# EAGLE design PDM_2019_RevB (EAGLE 9.1.3)

## Sheet 1 of 4
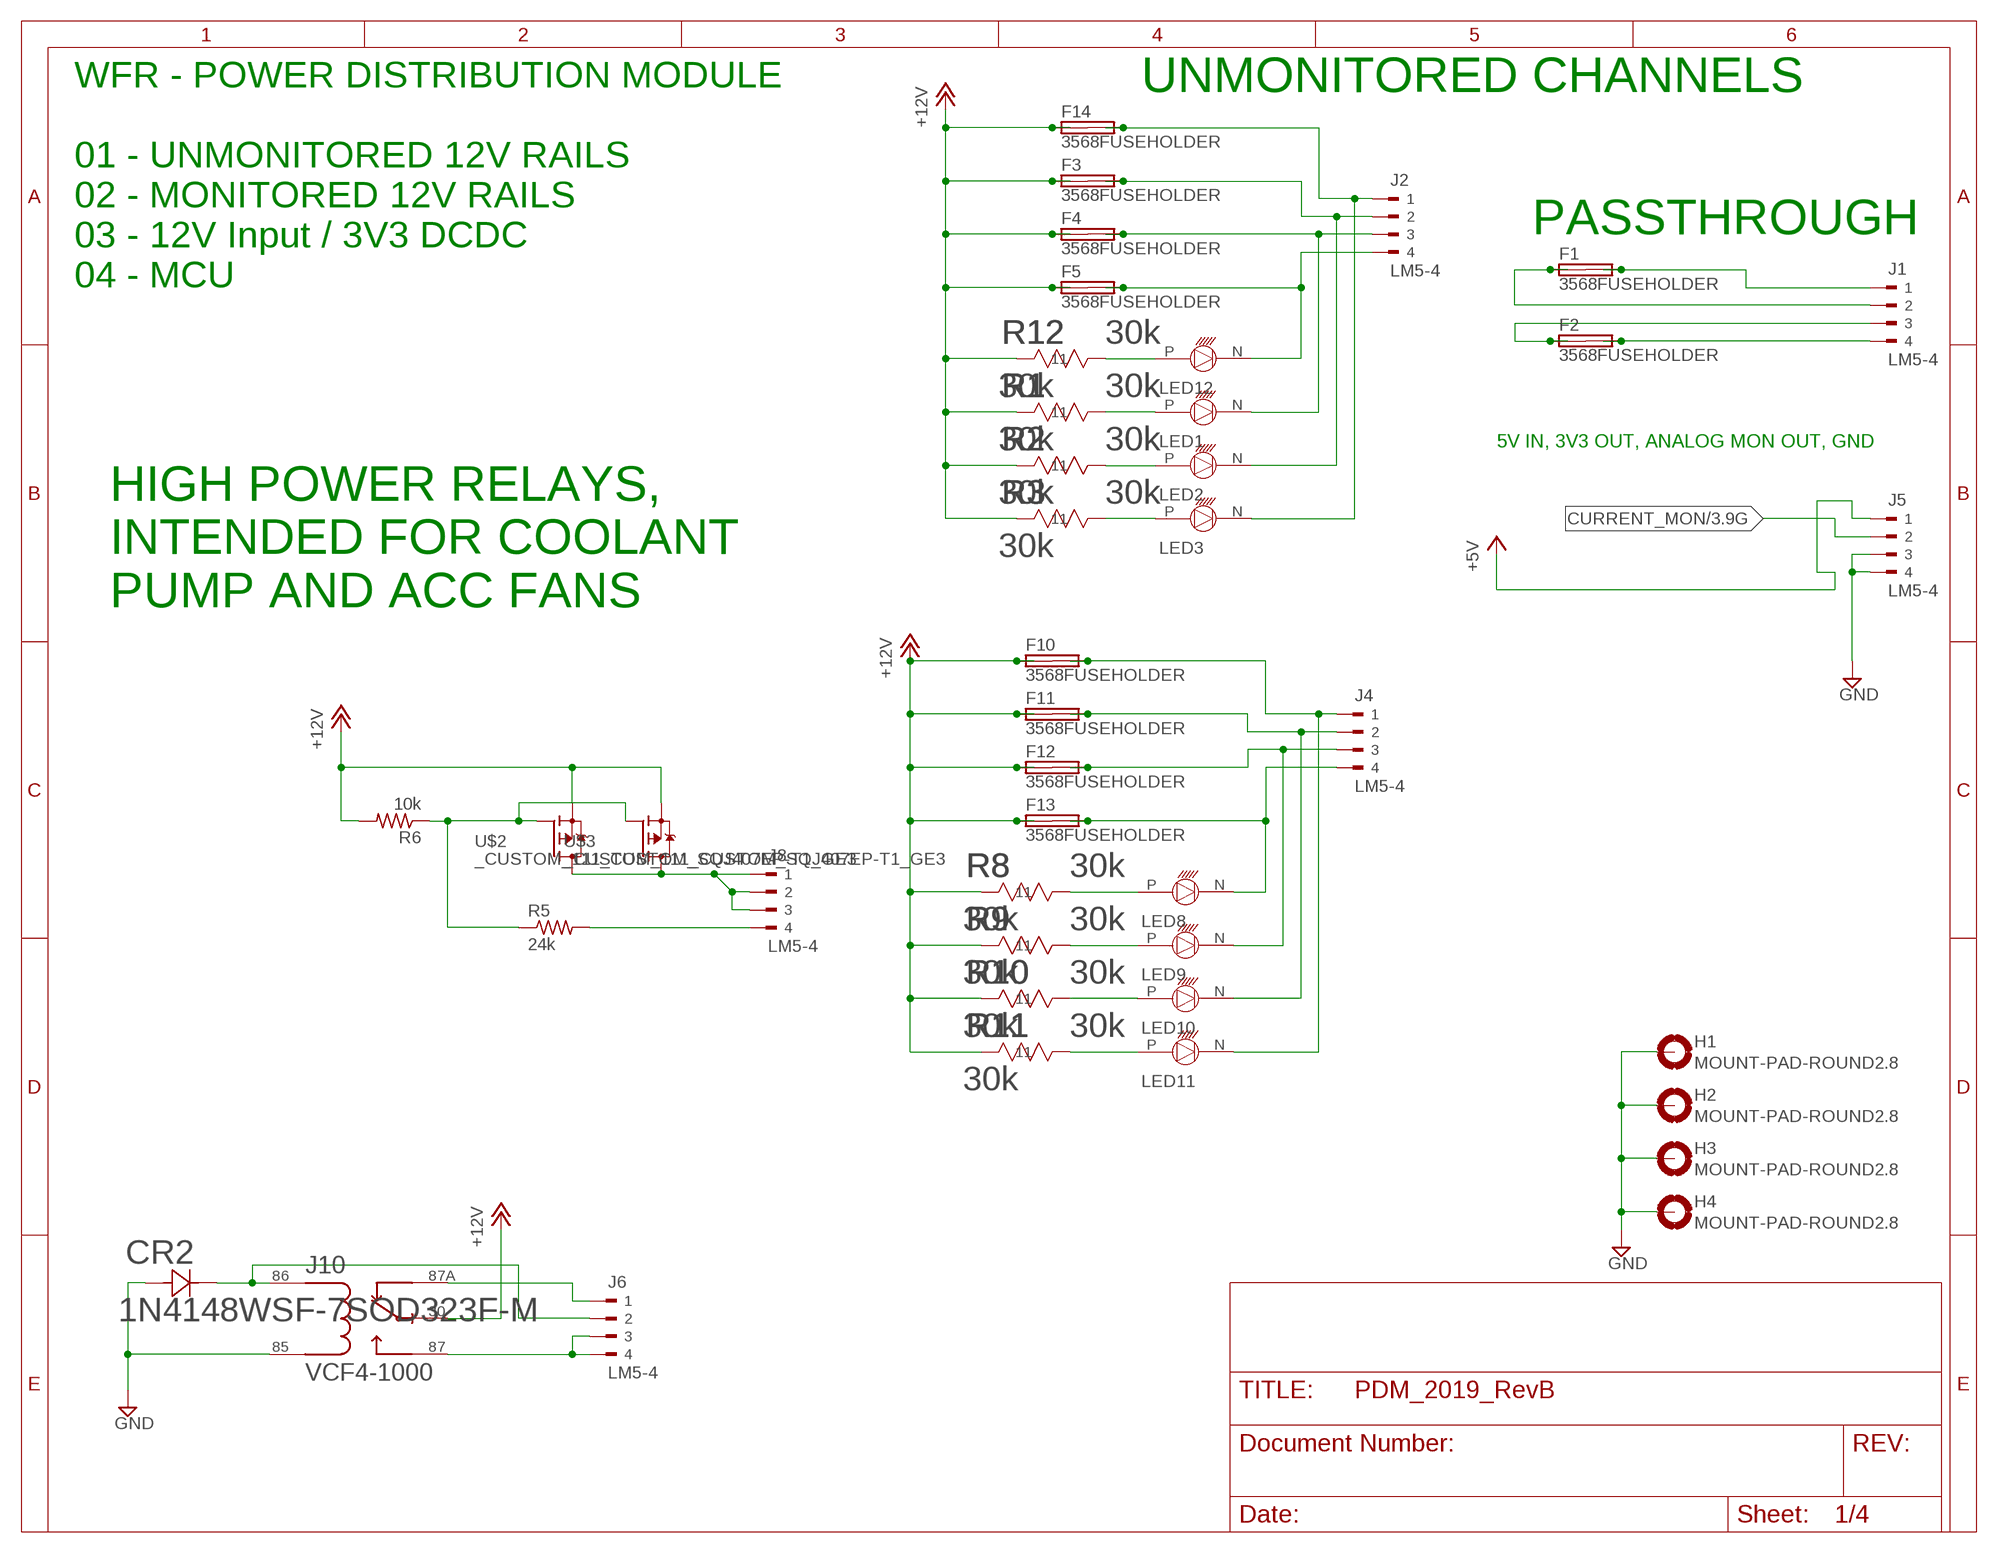
[diagram p0: schematic, sheet 1]

### Parts
CR2  1N4148WSF-7SOD323F-M  [SOD323F-M]
F1  3568FUSEHOLDER  [3568]
F2  3568FUSEHOLDER  [3568]
F3  3568FUSEHOLDER  [3568]
F4  3568FUSEHOLDER  [3568]
F5  3568FUSEHOLDER  [3568]
F10  3568FUSEHOLDER  [3568]
F11  3568FUSEHOLDER  [3568]
F12  3568FUSEHOLDER  [3568]
F13  3568FUSEHOLDER  [3568]
F14  3568FUSEHOLDER  [3568]
H1  MOUNT-PAD-ROUND2.8  [2,8-PAD]
H2  MOUNT-PAD-ROUND2.8  [2,8-PAD]
H3  MOUNT-PAD-ROUND2.8  [2,8-PAD]
H4  MOUNT-PAD-ROUND2.8  [2,8-PAD]
J1  LM5-4  [281-1423]
J2  LM5-4  [281-1423]
J4  LM5-4  [281-1423]
J5  LM5-4  [281-1423]
J6  LM5-4  [281-1423]
J8  LM5-4  [281-1423]
J10  VCF4-1000  [TE_VCF4-1000]
LED1  5MM_LED  [5MM_LED]
LED2  5MM_LED  [5MM_LED]
LED3  5MM_LED  [5MM_LED]
LED8  5MM_LED  [5MM_LED]
LED9  5MM_LED  [5MM_LED]
LED10  5MM_LED  [5MM_LED]
LED11  5MM_LED  [5MM_LED]
LED12  5MM_LED  [5MM_LED]
R1  30k  RMCF0805JT30K0  [STA_RMCF0805]
R2  30k  RMCF0805JT30K0  [STA_RMCF0805]
R3  30k  RMCF0805JT30K0  [STA_RMCF0805]
R5  24k  R-US_M0805  [M0805]
R6  10k  R-US_M0805  [M0805]
R8  30k  RMCF0805JT30K0  [STA_RMCF0805]
R9  30k  RMCF0805JT30K0  [STA_RMCF0805]
R10  30k  RMCF0805JT30K0  [STA_RMCF0805]
R11  30k  RMCF0805JT30K0  [STA_RMCF0805]
R12  30k  RMCF0805JT30K0  [STA_RMCF0805]
U$2  _CUSTOM_111_CUSTOM_SQJ407EP-T1_GE3  [_CUSTOM_111_CUSTOM_TRANS_SIRA90DP-T1-GE3]
U$3  _CUSTOM_111_CUSTOM_SQJ407EP-T1_GE3  [_CUSTOM_111_CUSTOM_TRANS_SIRA90DP-T1-GE3]

### Nets
+5V [SIG]: J5.P$1 ; also sheet 2,3,4
+12V: F3.L1(1A) F3.L2(1B) F4.L1(1A) F4.L2(1B) F5.L1(1A) F5.L2(1B) F10.L1(1A) F10.L2(1B) F11.L1(1A) F11.L2(1B) F12.L1(1A) F12.L2(1B) F13.L1(1A) F13.L2(1B) F14.L1(1A) F14.L2(1B) J10.30 R1.1 R2.1 R3.1 R6.2 R8.1 R9.1 R10.1 R11.1 R12.1 U$2.1(S) U$2.2(S) U$2.3(S) U$3.1(S) U$3.2(S) U$3.3(S) ; also sheet 2,3
CURRENT_MON [SIG]: J5.P$2 ; also sheet 3,4
GND [SIG]: CR2.2 H1.B2,8(MOUNT) H2.B2,8(MOUNT) H3.B2,8(MOUNT) H4.B2,8(MOUNT) J5.P$3 J5.P$4 J10.85 ; also sheet 2,3,4
N$1: F1.R1(2A) F1.R2(2B) J1.P$1
N$2: F1.L1(1A) F1.L2(1B) J1.P$2
N$3: F2.L1(1A) F2.L2(1B) J1.P$3
N$4: LED11.P R11.2
N$5: LED12.P R12.2
N$6: F4.R1(2A) F4.R2(2B) J2.P$3 LED1.N
N$7: F5.R1(2A) F5.R2(2B) J2.P$4 LED12.N
N$9: J8.P$4 R5.2
N$12: J8.P$1 J8.P$2 J8.P$3 U$2.5(D) U$3.5(D)
N$13: F10.R1(2A) F10.R2(2B) J4.P$1 LED11.N
N$14: F13.R1(2A) F13.R2(2B) J4.P$4 LED8.N
N$15: F12.R1(2A) F12.R2(2B) J4.P$3 LED9.N
N$16: F11.R1(2A) F11.R2(2B) J4.P$2 LED10.N
N$18: R5.1 R6.1 U$2.4(G) U$3.4(G)
N$19: LED10.P R10.2
N$21: LED8.P R8.2
N$22: CR2.1 J6.P$2 J10.86
N$24: LED9.P R9.2
N$25: F2.R1(2A) F2.R2(2B) J1.P$4
N$30: LED1.P R1.2
N$31: LED2.P R2.2
N$32: LED3.P R3.2
N$33: F3.R1(2A) F3.R2(2B) J2.P$2 LED2.N
N$34: F14.R1(2A) F14.R2(2B) J2.P$1 LED3.N
N$40: J6.P$3 J6.P$4 J10.87
N$45: J6.P$1 J10.87A

### Notes on the sheet
- UNMONITORED CHANNELS
- PASSTHROUGH
- WFR - POWER DISTRIBUTION MODULE
  
  01 - UNMONITORED 12V RAILS
  02 - MONITORED 12V RAILS
  03 - 12V Input / 3V3 DCDC
  04 - MCU
- 5V IN, 3V3 OUT, ANALOG MON OUT, GND
- HIGH POWER RELAYS,
  INTENDED FOR COOLANT 
  PUMP AND ACC FANS

## Sheet 2 of 4
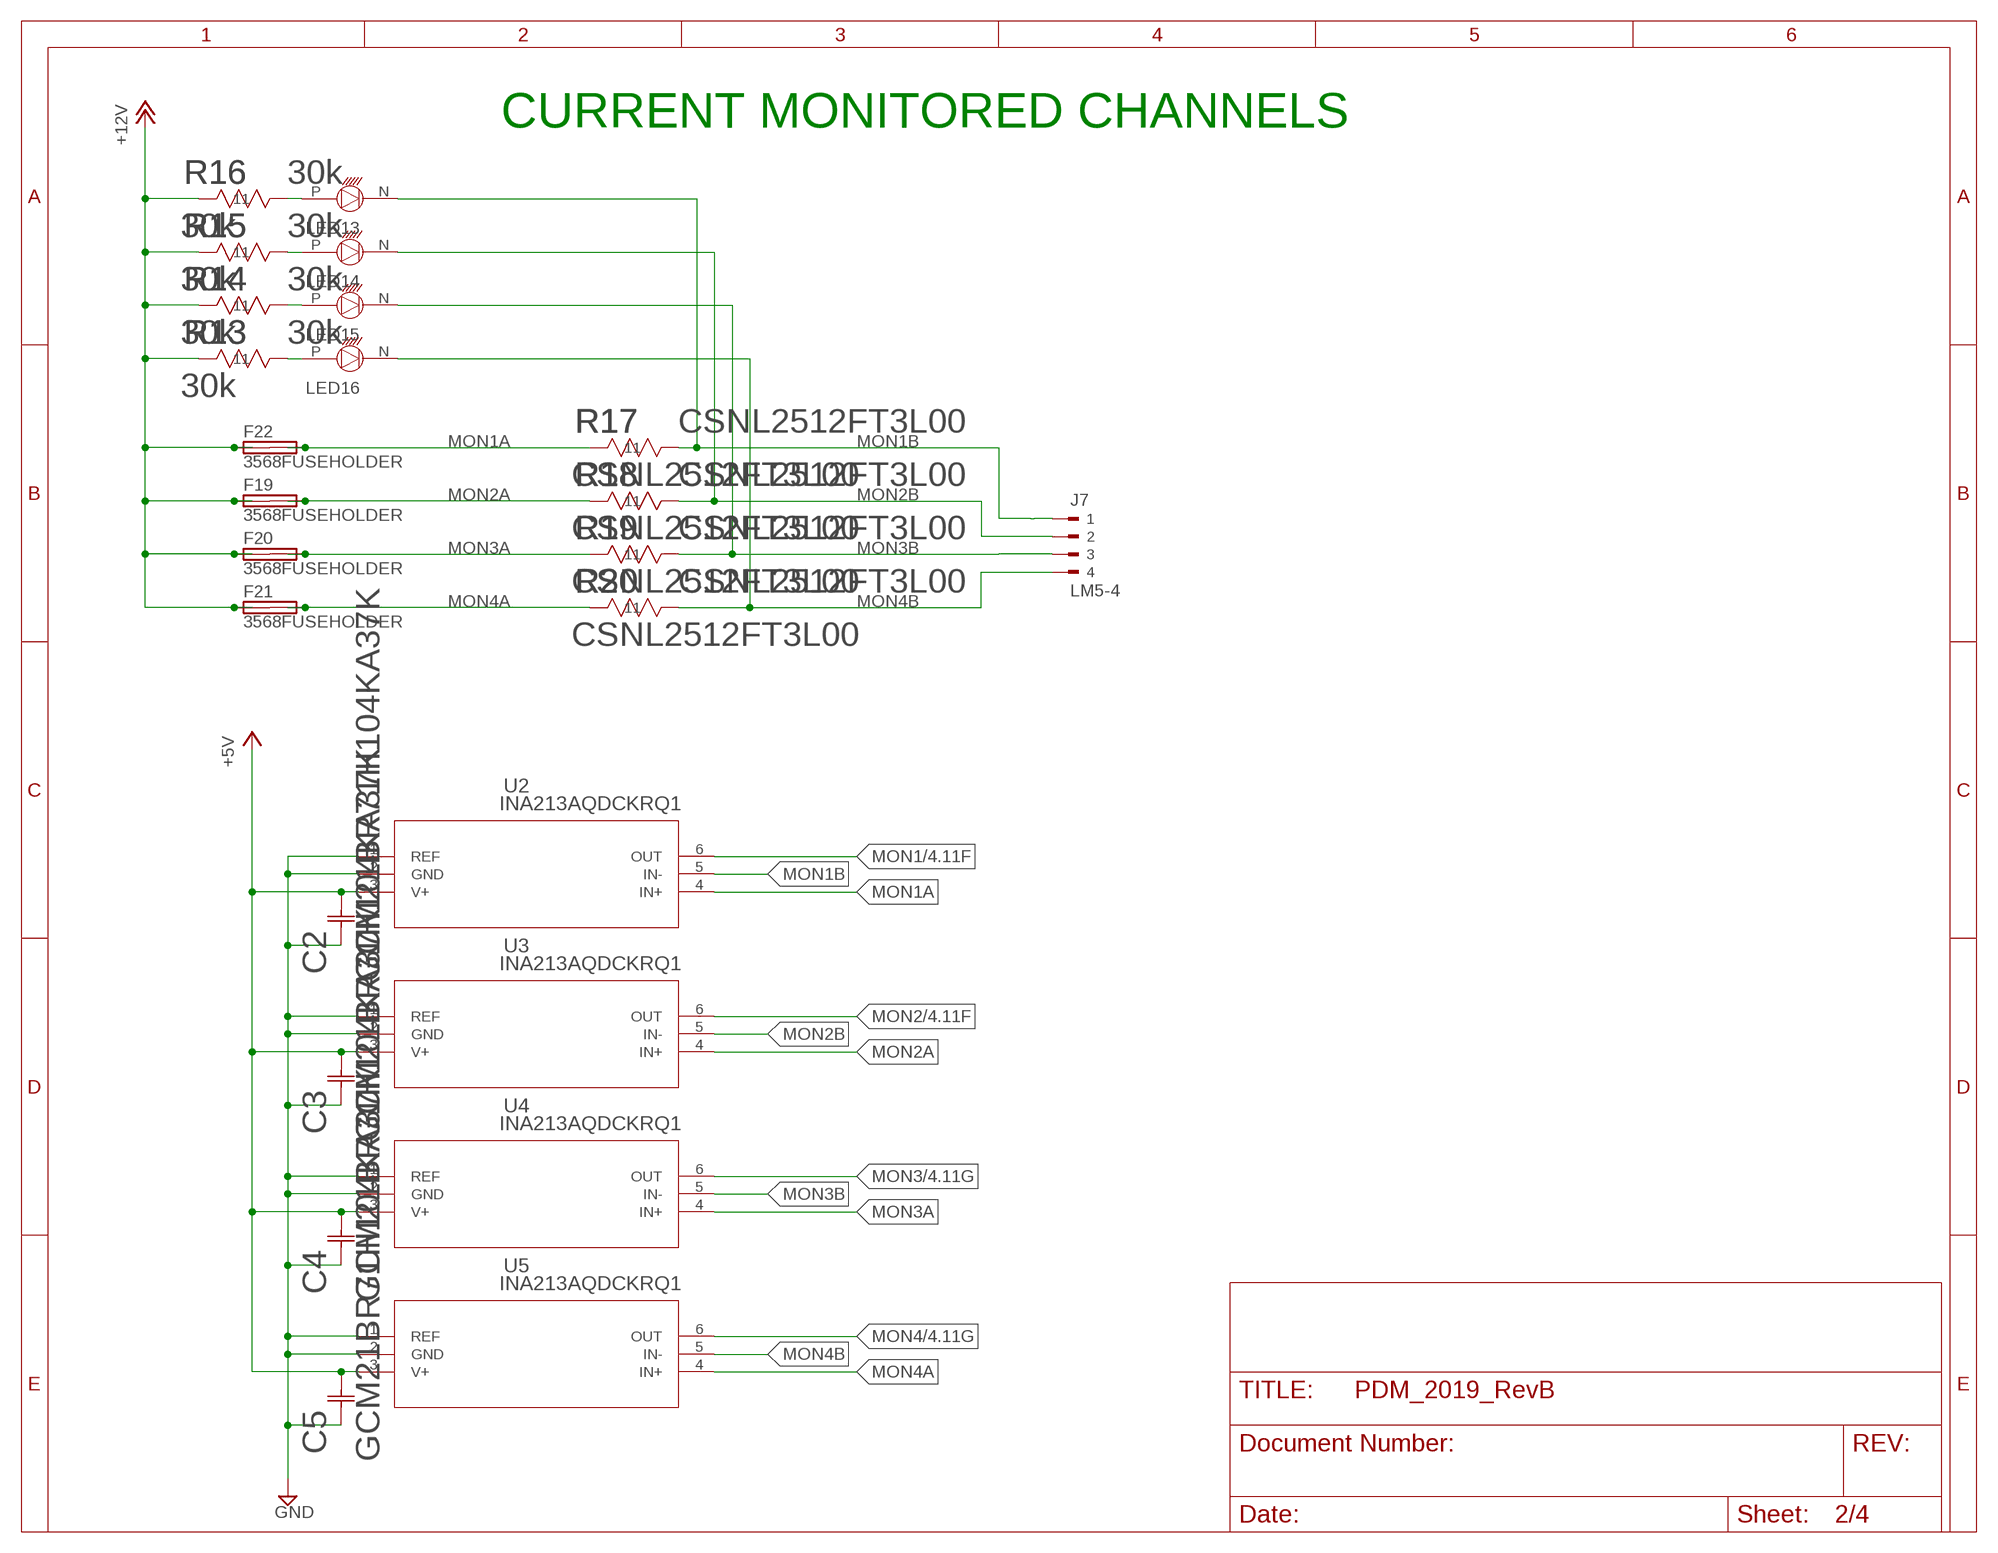
[diagram p1: schematic, sheet 2]

### Parts
C2  GCM21BR71H104KA37K  [G-21]
C3  GCM21BR71H104KA37K  [G-21]
C4  GCM21BR71H104KA37K  [G-21]
C5  GCM21BR71H104KA37K  [G-21]
F19  3568FUSEHOLDER  [3568]
F20  3568FUSEHOLDER  [3568]
F21  3568FUSEHOLDER  [3568]
F22  3568FUSEHOLDER  [3568]
J7  LM5-4  [281-1423]
LED13  5MM_LED  [5MM_LED]
LED14  5MM_LED  [5MM_LED]
LED15  5MM_LED  [5MM_LED]
LED16  5MM_LED  [5MM_LED]
R13  30k  RMCF0805JT30K0  [STA_RMCF0805]
R14  30k  RMCF0805JT30K0  [STA_RMCF0805]
R15  30k  RMCF0805JT30K0  [STA_RMCF0805]
R16  30k  RMCF0805JT30K0  [STA_RMCF0805]
R17  CSNL2512FT3L00  [STA_CSNL2512(3)]
R18  CSNL2512FT3L00  [STA_CSNL2512(3)]
R19  CSNL2512FT3L00  [STA_CSNL2512(3)]
R20  CSNL2512FT3L00  [STA_CSNL2512(3)]
U2  INA213AQDCKRQ1  [DCK6]
U3  INA213AQDCKRQ1  [DCK6]
U4  INA213AQDCKRQ1  [DCK6]
U5  INA213AQDCKRQ1  [DCK6]

### Nets
+5V [SIG]: C2.2 C3.2 C4.2 C5.2 U2.3(V+) U3.3(V+) U4.3(V+) U5.3(V+) ; also sheet 1,3,4
+12V: F19.L1(1A) F19.L2(1B) F20.L1(1A) F20.L2(1B) F21.L1(1A) F21.L2(1B) F22.L1(1A) F22.L2(1B) R13.1 R14.1 R15.1 R16.1 ; also sheet 1,3
GND [SIG]: C2.1 C3.1 C4.1 C5.1 U2.1(REF) U2.2(GND) U3.1(REF) U3.2(GND) U4.1(REF) U4.2(GND) U5.1(REF) U5.2(GND) ; also sheet 1,3,4
MON1 [SIG]: U2.6(OUT) ; also sheet 4
MON1A [SIG]: F22.R1(2A) F22.R2(2B) R17.1 U2.4(IN+)
MON1B [SIG]: J7.P$1 LED13.N R17.2 U2.5(IN-)
MON2 [SIG]: U3.6(OUT) ; also sheet 4
MON2A [SIG]: F19.R1(2A) F19.R2(2B) R18.1 U3.4(IN+)
MON2B [SIG]: J7.P$2 LED14.N R18.2 U3.5(IN-)
MON3 [SIG]: U4.6(OUT) ; also sheet 4
MON3A [SIG]: F20.R1(2A) F20.R2(2B) R19.1 U4.4(IN+)
MON3B [SIG]: J7.P$3 LED15.N R19.2 U4.5(IN-)
MON4 [SIG]: U5.6(OUT) ; also sheet 4
MON4A [SIG]: F21.R1(2A) F21.R2(2B) R20.1 U5.4(IN+)
MON4B [SIG]: J7.P$4 LED16.N R20.2 U5.5(IN-)
N$36: LED16.P R13.2
N$37: LED15.P R14.2
N$38: LED14.P R15.2
N$39: LED13.P R16.2

### Notes on the sheet
- CURRENT MONITORED CHANNELS

## Sheet 3 of 4
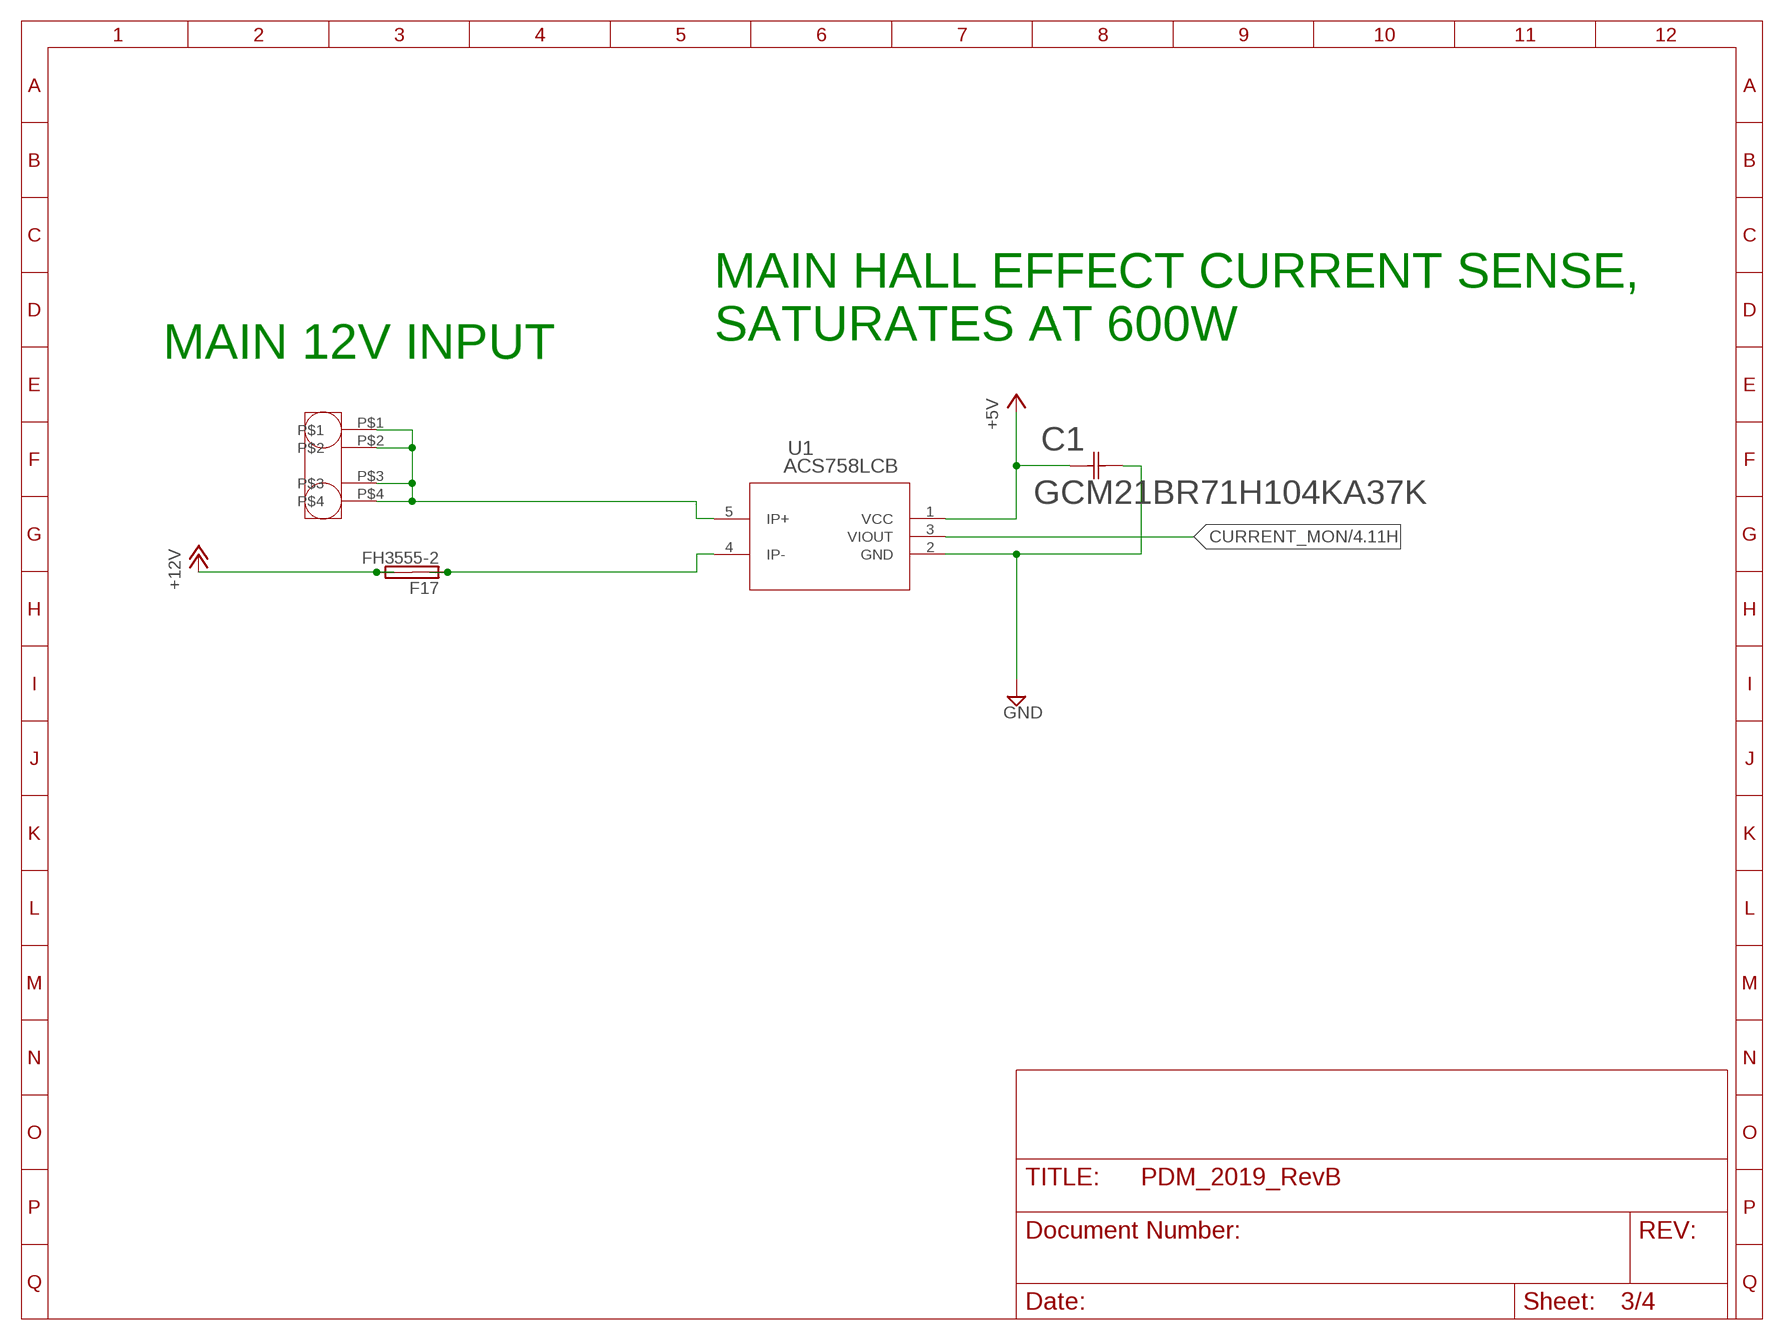
[diagram p2: schematic, sheet 3]

### Parts
C1  GCM21BR71H104KA37K  [G-21]
F17  FH3555-2  [3555-2]
U1  ACS758LCB  [PFF-5]
U$1  1773976  [1773976]

### Nets
+5V [SIG]: C1.1 U1.1(VCC) ; also sheet 1,2,4
+12V: F17.R1(2A) F17.R2(2B) ; also sheet 1,2
CURRENT_MON [SIG]: U1.3(VIOUT) ; also sheet 1,4
GND [SIG]: C1.2 U1.2(GND) ; also sheet 1,2,4
N$8 [RAIL2]: U1.5(IP+) U$1.P$1 U$1.P$2 U$1.P$3 U$1.P$4
N$20 [RAIL2]: F17.L1(1A) F17.L2(1B) U1.4(IP-)

### Notes on the sheet
- MAIN HALL EFFECT CURRENT SENSE,
  SATURATES AT 600W
- MAIN 12V INPUT

## Sheet 4 of 4
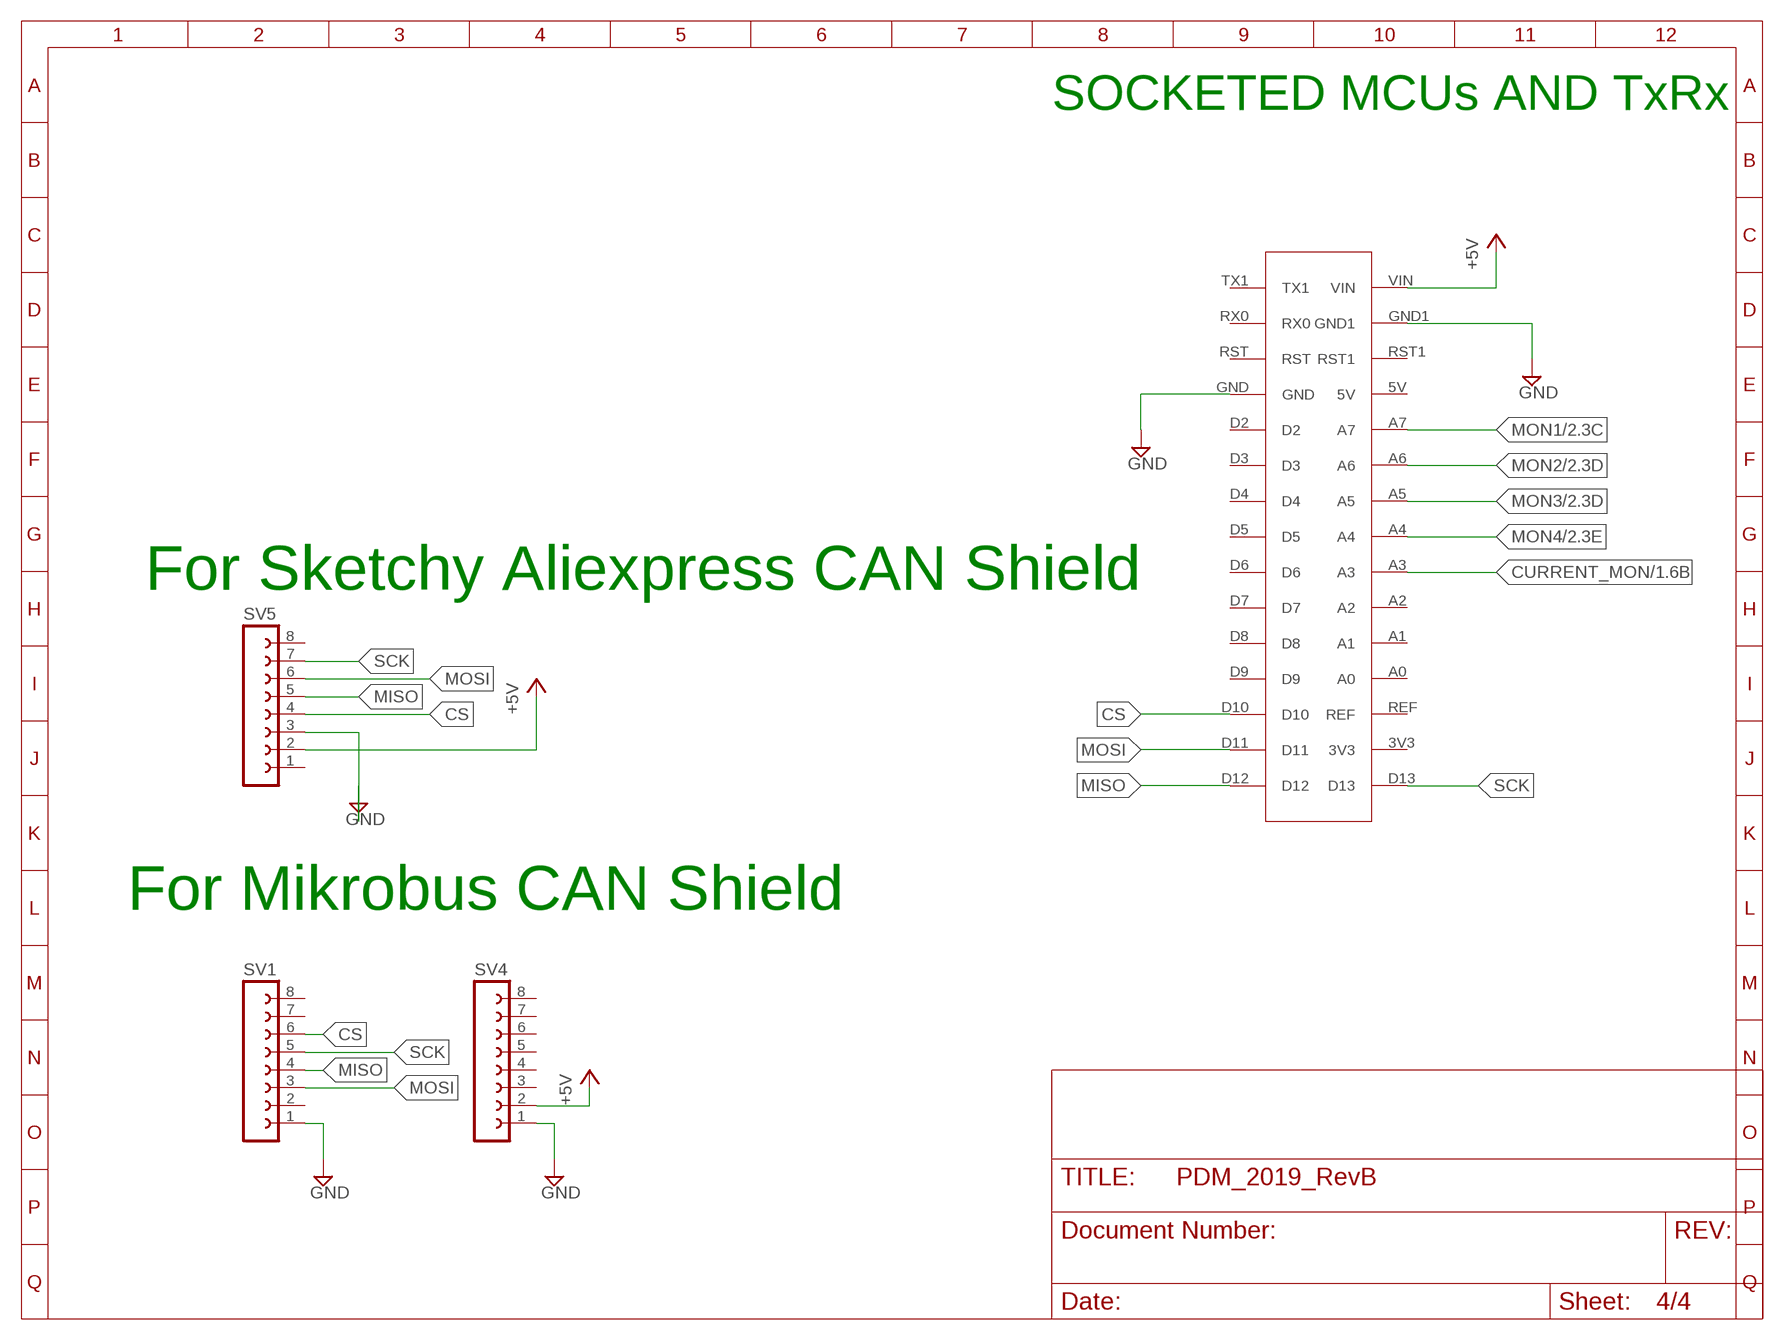
[diagram p3: schematic, sheet 4]

### Parts
SV1  FE08-1  [FE08]
SV4  FE08-1  [FE08]
SV5  FE08-1  [FE08]
U$4  NANO  [NANO]

### Nets
+5V [SIG]: SV4.2 ; also sheet 1,2,3
CS [SIG]: SV1.6 SV5.4 U$4.D10
CURRENT_MON [SIG]: U$4.A3 ; also sheet 1,3
GND [SIG]: SV1.1 SV4.1 U$4.GND U$4.GND1 ; also sheet 1,2,3
MISO [SIG]: SV1.4 SV5.5 U$4.D12
MON1 [SIG]: U$4.A7 ; also sheet 2
MON2 [SIG]: U$4.A6 ; also sheet 2
MON3 [SIG]: U$4.A5 ; also sheet 2
MON4 [SIG]: U$4.A4 ; also sheet 2
MOSI [SIG]: SV1.3 SV5.6 U$4.D11
N$23: U$4.VIN
N$49: SV5.3
N$50 [SIG]: SV5.2 ; supply symbol labelled +5V
SCK [SIG]: SV1.5 SV5.7 U$4.D13
Unconnected: SV1.2 SV1.7 SV1.8 SV4.3 SV4.4 SV4.5 SV4.6 SV4.7 SV4.8 SV5.1 SV5.8 U$4.3V3 U$4.5V U$4.A0 U$4.A1 U$4.A2 U$4.D2 U$4.D3 U$4.D4 U$4.D5 U$4.D6 U$4.D7 U$4.D8 U$4.D9 U$4.REF U$4.RST U$4.RST1 U$4.RX0 U$4.TX1

### Notes on the sheet
- SOCKETED MCUs AND TxRx
- For Sketchy Aliexpress CAN Shield
- For Mikrobus CAN Shield

## Library data of the parts
C1-C5 = PDM_2019_RevB:GCM21BR71H104KA37K; MANUFACTURER_PART_NUMBER: GCM21BR71H104KA37K; VENDOR: Murata
CR2 = PDM_2019_RevB:1N4148WSF-7; MANUFACTURER_PART_NUMBER: 1N4148WSF7; VENDOR: Diodes Inc
F1-F5 F10-F14 F19-F22 = fuse:3568FUSEHOLDER: 3568 20AMP 500VAC
F17 = fuse:FH3555-2
H1-H4 = holes:MOUNT-PAD-ROUND: MOUNTING PAD, round
J1 J2 J4-J8 = con-weidmueller-sl35:LM5-4
J10 = PDM_2019_RevB:VCF4-1000: Socket, Relay; PCB, VTF Series, 1 Pole, Quick-Connect, w/o Grounding Provision; COMMENT: 1393310-3; DESCRIPTION: VCF4-1000=FROM SEC; DIGI-KEY_PART_NUMBER: PB232-ND; DIGI-KEY_PURCHASE_URL: https://www.digikey.ca/product-detail/en/te-connectivity-potter-brumfield-relays/VCF4-1000/PB232-ND/207273?utm_source=snapeda&utm_medium=aggregator&utm_campaign=symbol; MF: TE Connectivity; MP: VCF4-1000; PACKAGE: None; PRODUCT_TYPE: Socket; TE_PURCHASE_URL: https://www.te.com/usa-en/product-1393310-3.html?te_bu=Cor&te_type=disp&te_campaign=seda_glo_cor-seda-global-disp-prtnr-fy19-seda-model-bom-cta_sma-317_1&elqCampaignId=32493
LED1-LED3 LED8-LED16 = PDM_2019_RevB:5MM_LED
R1-R3 R8-R16 = PDM_2019_RevB:RMCF0805JT30K0; MANUFACTURER_PART_NUMBER: RMCF0805JT30K0; VENDOR: Stackpole International
R5 R6 = adafruit:R-US_: RESISTOR, American symbol
R17-R20 = PDM_2019_RevB:CSNL2512FT3L00; MANUFACTURER_PART_NUMBER: CSNL2512FT3L00; VENDOR: Stackpole International
SV1 SV4 SV5 = con-lsta:FE08-1: FEMALE HEADER; OC_FARNELL: unknown; OC_NEWARK: unknown
U1 = PDM_2019_RevB:ACS758LCB; MANUFACTURER_PART_NUMBER: LLC; VENDOR: Allegro Microsystems Inc.
U2-U5 = PDM_2019_RevB:INA213AQDCKRQ1; MANUFACTURER_PART_NUMBER: INA213AQDCKRQ1; VENDOR: Texas Instruments
U$1 = PDM_2019_RevB:1773976
U$2 U$3 = PDM_2019_RevB:_CUSTOM_111_CUSTOM_SQJ407EP-T1_GE3
U$4 = DASHBOARD:NANO

## Net classes
0 RAIL1: width 0.4 mm, drill 0.5 mm, clearance 0.2 mm
1 GND: width 0.4 mm, drill 0.5 mm, clearance 0.2 mm
2 RAIL2: width 0.4 mm, drill 0.5 mm, clearance 0.2 mm
3 SIG: width 0.3 mm, drill 0.5 mm, clearance 0.2 mm

## Board
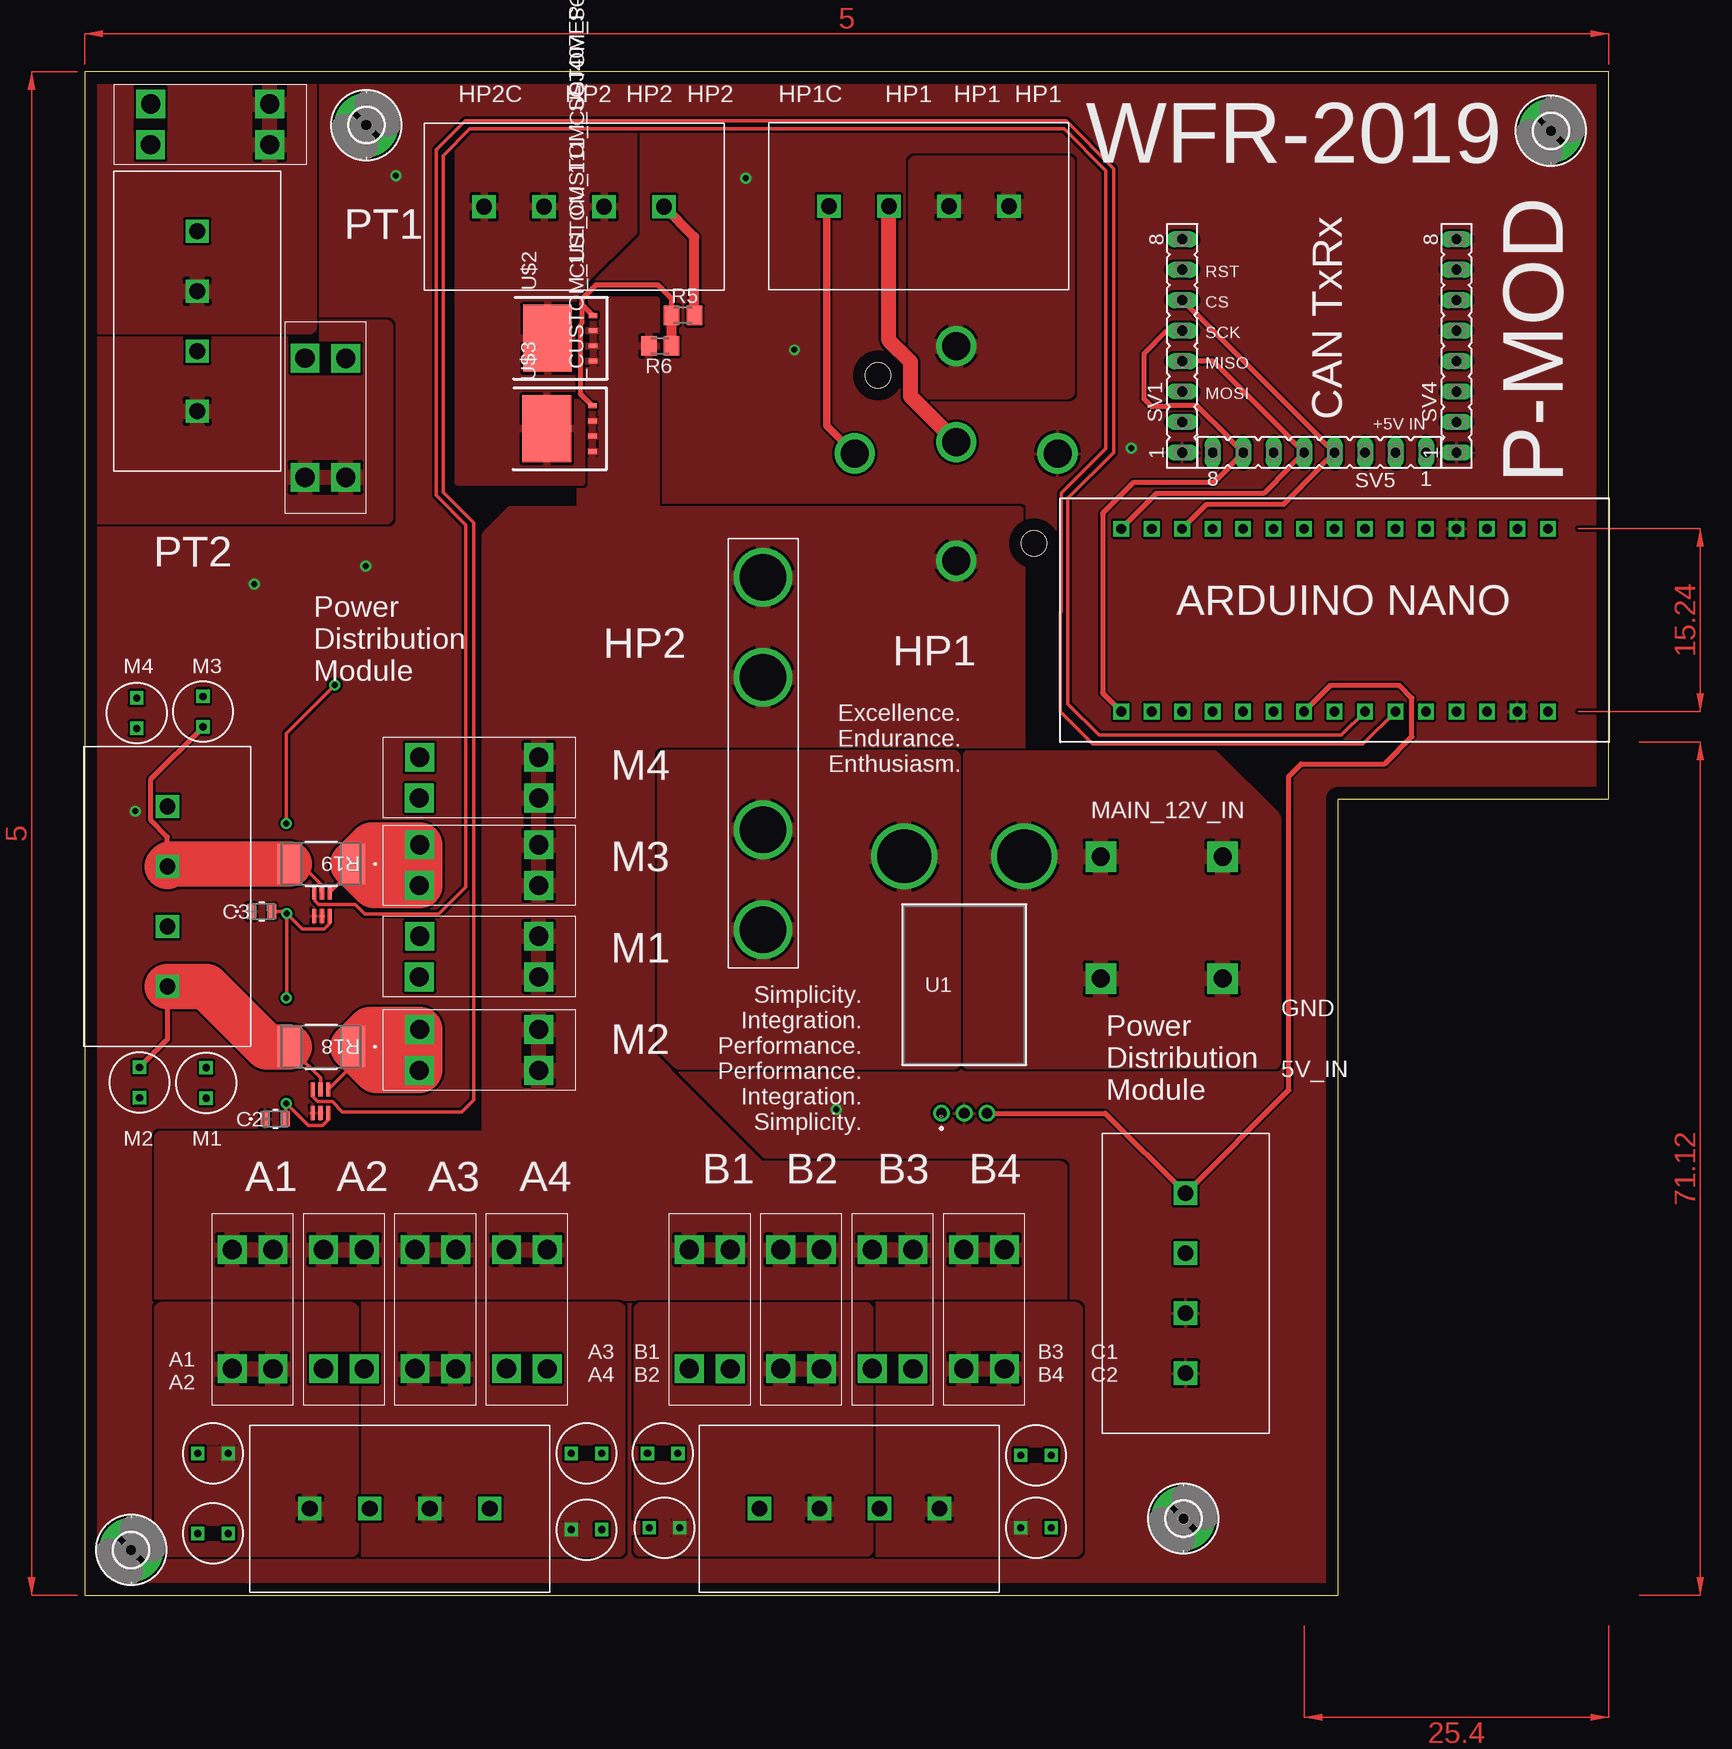
[diagram p4: board, top side]
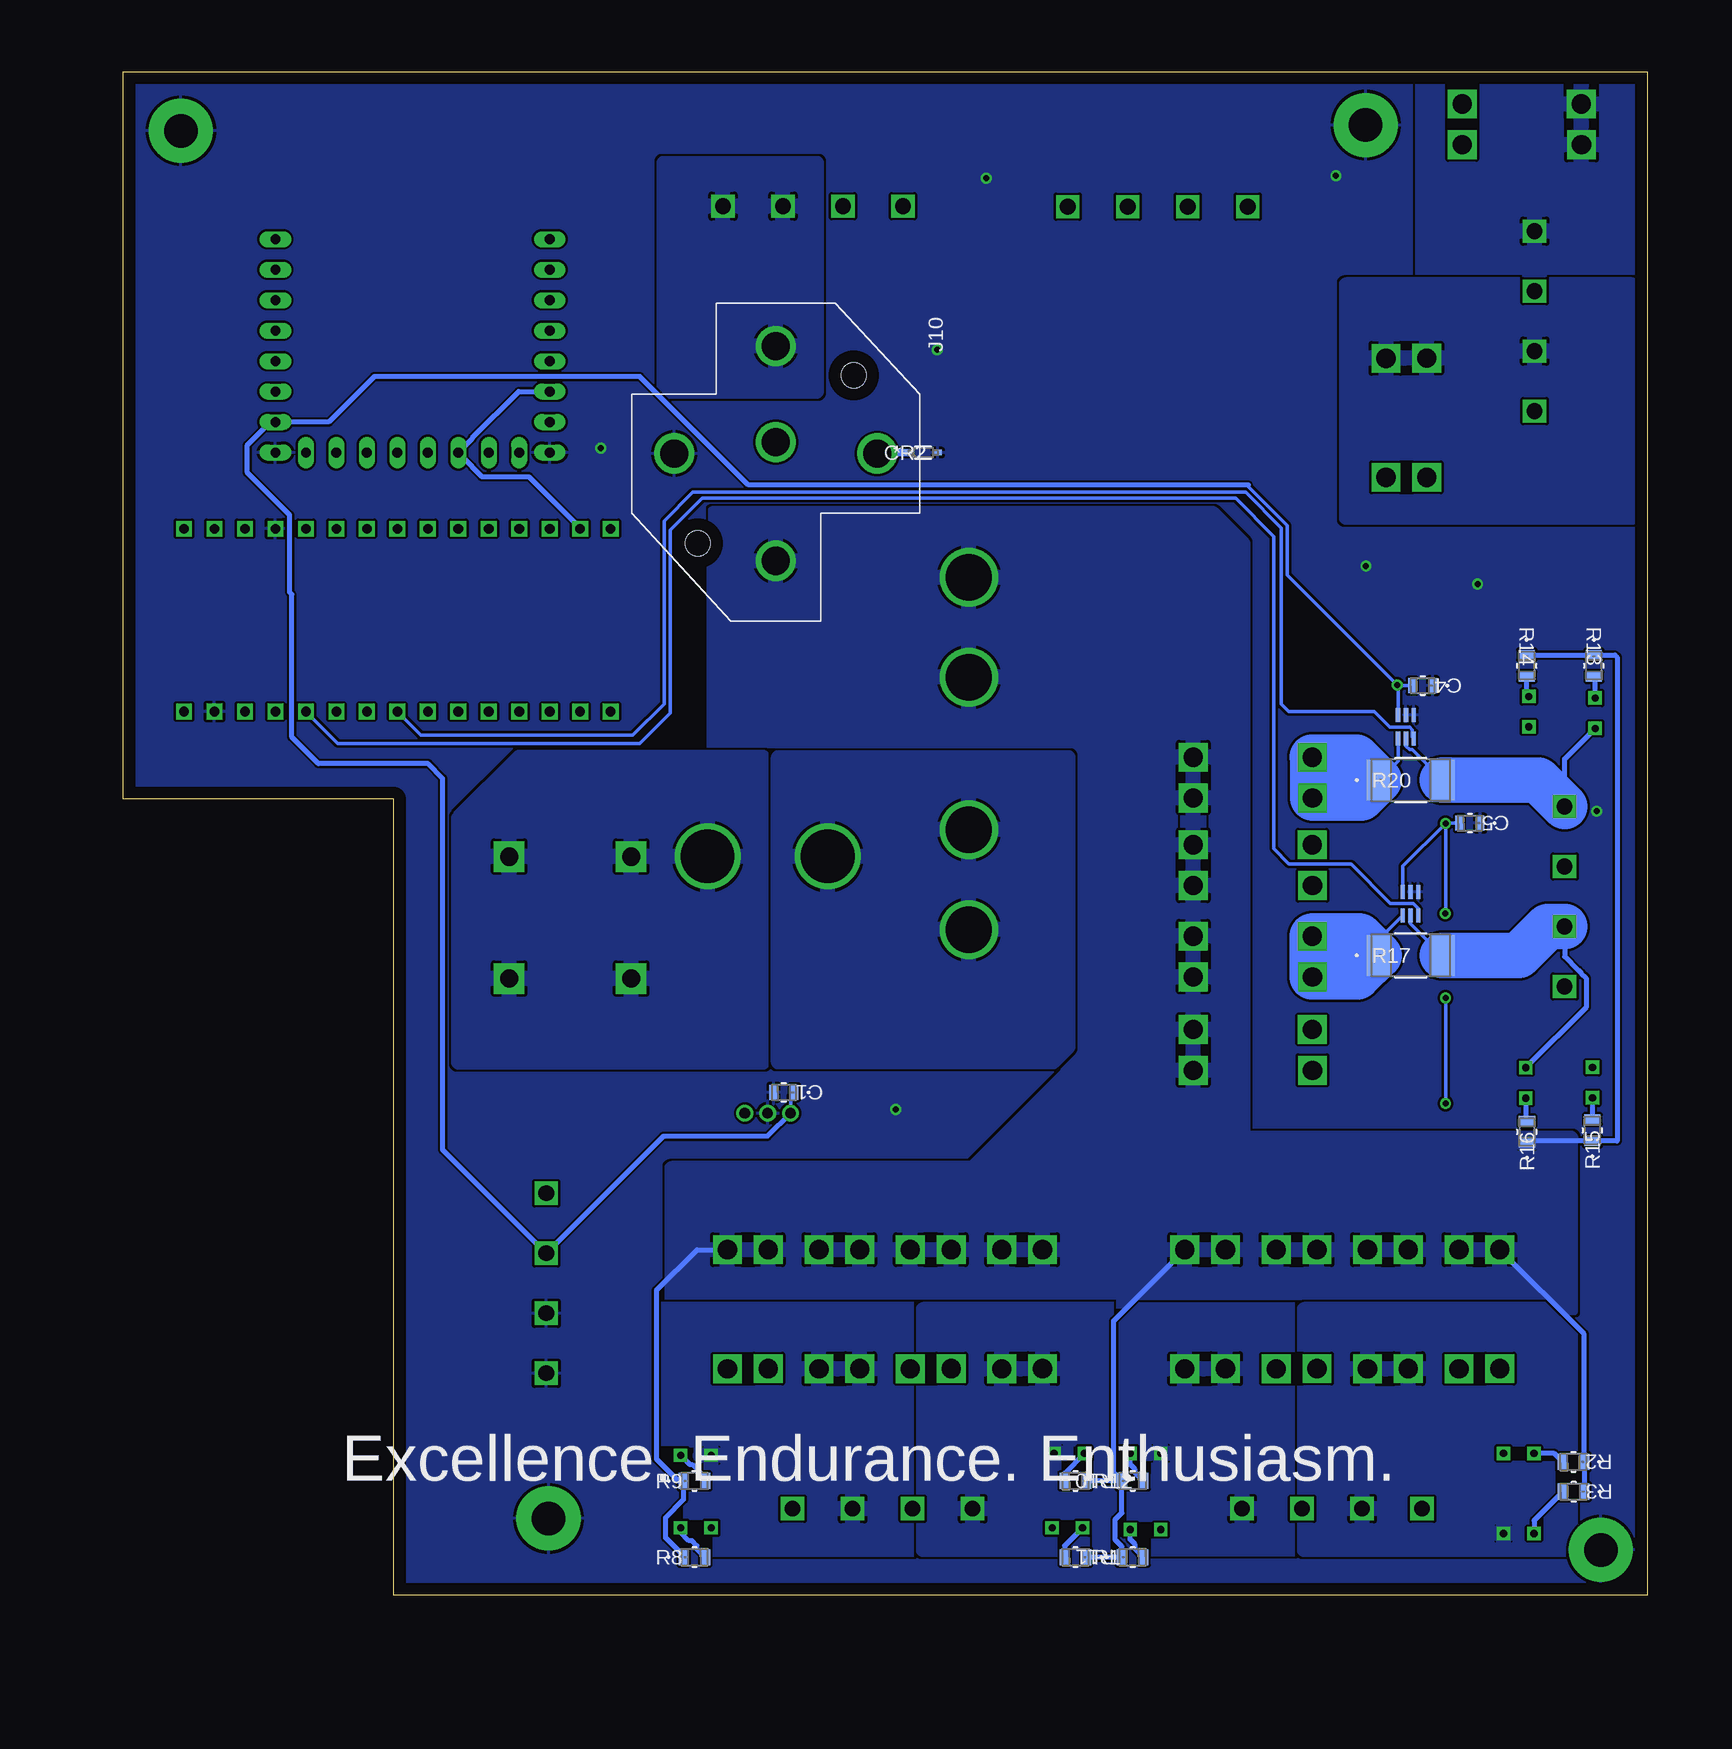
[diagram p5: board, bottom side, seen from below]

Size 127 x 127 mm. Coordinates in mm from the lower left corner, seen from the top.
Outline: 0,0 104.46,0 104.46,66.36 127,66.36 127,127 0,127 0,0
Copper layers (1*16): Top 0.035mm / dielectric 1.5mm / Bottom 0.035mm
Design rules "default": minimum track width 6mil, minimum drill 0.35mm, track to track 6mil, track to pad 6mil, pad to pad 6mil, via to via 6mil, smd to smd 6mil, copper to edge 40mil, drill to drill 6mil, minimum pad ring 10mil, minimum via ring 8mil, stop-mask expansion 4mil, vias tented up to drill 0mil, thermal gap 10mil

### Footprints (pad centres in the part's own frame; a part is rotated, then mirrored left to right if it is on the bottom)
G-21 = smd 0.711 x 1.245: 1 -0.851,0; 2 0.851,0
SOD323F-M = smd 0.705 x 0.452: 1 -1.202,0; 2 1.202,0
3568 = drill 1.6 square: L1 0,3.4; L2 0,0; R1 9.94,3.4; R2 9.92,0
3555-2 = drill 3.86: L1 -14.68,0; L2 -6.35,0; R1 6.35,0; R2 14.68,0
2,8-PAD = drill 2.8 pad 5.334: B2,8 0,0
281-1423 = drill 1.3 square: P$1 -2.5,0; P$2 -7.5,0; P$3 2.5,0; P$4 7.5,0
TE_VCF4-1000 = drill 2.337: 30 8.95,0; 85 0,-8.45; 86 0,8.45; 87 -8.95,0; 87A -0.95,0 | hole 2.1: 7.5,-6.5; -6.5,6.5
5MM_LED = drill 0.6 square: N 0,-1.27; P 0,1.27
STA_RMCF0805 = smd 0.813 x 1.346: 1 -0.902,0; 2 0.902,0
M0805 = smd 1.3 x 1.6: 1 -0.95,0; 2 0.95,0
STA_CSNL2512(3) = smd 2.032 x 3.429: 1 -2.642,0; 2 2.642,0
FE08 = drill 0.813 long: 1 -8.89,0; 2 -6.35,0; 3 -3.81,0; 4 -1.27,0; 5 1.27,0; 6 3.81,0; 7 6.35,0; 8 8.89,0
PFF-5 = drill 0.889 pad 1.397: 1 -3.81,-21.412; 2 -1.905,-21.412; 3 0,-21.412 | drill 4.47 pad 4.978: 4 -6.909,0; 5 3.099,0
DCK6 = smd 1.168 x 0.356: 1 -0.978,0.65; 2 -0.978,0; 3 -0.978,-0.65; 4 0.978,-0.65; 5 0.978,0; 6 0.978,0.65
1773976 = drill 1.51 pad 2.54 square: P$1 0,0; P$2 0,10.16; P$3 10.16,10.16; P$4 10.16,0
_CUSTOM_111_CUSTOM_TRANS_SIRA90DP-T1-GE3 = smd 0.41 x 0.72: 1 -1.905,-2.715; 2 -0.635,-2.715; 3 0.635,-2.715; 4 1.905,-2.715 | smd 5.588 x 4.064: 5 0,1.08
NANO = drill 0.8 square: 3V3 2.54,0; 5V 27.94,0; A0 7.62,0; A1 10.16,0; A2 12.7,0; A3 15.24,0; A4 17.78,0; A5 20.32,0; A6 22.86,0; A7 25.4,0; D2 25.4,15.24; D3 22.86,15.24; D4 20.32,15.24; D5 17.78,15.24; D6 15.24,15.24; D7 12.7,15.24; D8 10.16,15.24; D9 7.62,15.24; D10 5.08,15.24; D11 2.54,15.24; D12 0,15.24; D13 0,0; GND 27.94,15.24; GND1 33.02,0; REF 5.08,0; RST 30.48,15.24; RST1 30.48,0; RX0 33.02,15.24; TX1 35.56,15.24; VIN 35.56,0

### Placement (x,y rotation side)
C1  71.93,41.92 180 bottom
C2  15.88,39.7 0 top
C3  14.73,57 0 top
C4  18.69,75.82 180 bottom
C5  14.76,64.36 180 bottom
CR2  60.33,95.25 0 bottom
F1  21.75,93.19 90 top
F2  15.4,124.3 180 top
F3  12.27,28.8 270 top
F4  27.51,28.8 270 top
F5  35.13,28.8 270 top
F10  57.99,28.8 270 top
F11  50.37,28.8 270 top
F12  65.61,28.8 270 top
F13  73.23,28.8 270 top
F14  19.89,28.8 270 top
F17  56.52,70.17 90 top
F19  37.81,47.16 180 top
F20  37.81,62.55 180 top
F21  37.81,69.86 180 top
F22  37.81,54.93 180 top
H1  91.54,6.39 0 top
H2  23.45,122.56 0 top
H3  3.85,3.77 0 top
H4  122.17,122.07 0 top
J1  9.37,106.2 90 top
J2  26.24,7.21 0 top
J4  63.7,7.21 0 top
J5  91.73,26 270 top
J6  69.5,115.79 0 top
J7  6.87,58.24 90 top
J8  40.77,115.75 0 top
J10  72.61,95.17 270 bottom
LED1  41.8,5.47 270 top
LED2  10.68,11.82 90 top
LED3  10.68,5.15 90 top
LED8  79.26,5.63 270 top
LED9  79.26,11.66 270 top
LED10  48.15,11.82 90 top
LED11  48.3,5.63 90 top
LED12  41.8,11.82 270 top
LED13  10.1,42.71 180 top
LED14  4.55,42.74 180 top
LED15  9.84,73.65 0 top
LED16  4.32,73.53 0 top
R1  42.86,3.17 0 bottom
R2  6.13,11.12 180 bottom
R3  6.11,8.64 180 bottom
R5  49.85,106.68 0 top
R6  47.94,104.14 180 top
R8  79.38,3.17 0 bottom
R9  79.38,9.53 0 bottom
R10  47.62,9.53 180 bottom
R11  47.62,3.17 180 bottom
R12  42.86,9.53 0 bottom
R13  4.43,77.48 270 bottom
R14  10.03,77.48 270 bottom
R15  4.55,38.75 90 bottom
R16  10,38.63 90 bottom
R17  19.68,53.34 0 bottom
R18  19.68,45.72 180 top
R19  19.68,60.96 180 top
R20  19.68,67.94 0 bottom
SV1  91.44,104.14 90 top
SV4  114.3,104.14 90 top
SV5  102.87,95.25 180 top
U1  75.18,61.59 0 top
U2  19.71,57.63 270 bottom
U3  19.63,41.2 90 top
U4  19.76,57.58 90 top
U5  20.09,72.39 270 bottom
U$1  94.82,61.56 180 top
U$2  39.63,104.78 90 top
U$3  39.57,97.24 90 top
U$4  86.36,73.66 0 top

### Tracks (layer width: path | path; a pad name or v marks a point on that pad's centre or on a via)
+5V  (via drill 0.5)
  Top 0.3: v16.79,64.34 16.79,71.83 v20.83,75.87 | v16.82,56.82 18.09,55.54 19.96,55.54 20.42,56 U4.3 | v16.82,56.82 16.82,49.81 v16.79,49.78 | U3.3 20.28,39.61 19.84,39.17 18.62,39.17 v16.79,41 16.73,40.93 C2.2 | C3.2 16.64,57 v16.82,56.82
  Bottom 0.3: 70.87,41.71 C1.1 | 71.37,41.62 C1.1 | U2.3 20.36,60.77 v16.79,64.34 | v20.83,75.87 20.74,75.78 U5.3 | v20.83,75.87 29.98,85.02 29.98,89.18 33.23,92.43 33.23,92.55 | v16.79,64.34 16.79,56.84 v16.82,56.82 | v16.79,49.78 v16.79,41 | C5.2 16.76,64.36 v16.79,64.34 | C4.2 20.78,75.82 v20.83,75.87 | U1.1 71.37,41.62 | 71.37,41.62 C1.1
  Bottom 0.4: 33.23,92.55 74.89,92.55 83.94,101.6
  Bottom 0.406: 83.94,101.6 106.05,101.6 109.86,97.79 SV4.2 114.73,97.79 116.64,95.89 116.64,93.57 113.12,90.05 113.12,83.6 112.93,83.41 112.93,71.53 110.72,69.32 101.58,69.32 100.36,68.1 100.36,37.13 J5.P$1 81.98,38.25 73.3,38.25 U1.1
+12V
  Bottom 0.4: R8.1 80.28,3.27 81.78,4.78 81.78,6.47 80.28,7.98 R9.1 80.72,9.53 82.55,11.35 82.55,25.4 79.15,28.8 F13.L1 | R11.1 R1.1 43.76,4.07 44.32,4.62 44.32,6.31 43.76,6.87 R12.1 | R12.1 R10.1 | R12.1 44.45,10.21 44.45,22.88 F5.L1 | R3.1 5.21,11.09 R2.1 5.23,21.77 F3.L2 | R14.1 R13.1 2.67,78.38 2.49,78.2 | 2.49,37.85 R15.1 9.87,37.85 R16.1
  Bottom 0.406: 2.49,78.2 2.49,37.85
  pour Top (rank 5): 6.35,23.81 81.28,23.81 81.28,35.56 56.2,35.56 48.26,43.5 48.26,70.17 77.79,70.17 77.79,86.36 77.79,90.17 35.56,90.17 33.66,88.27 33.66,38.1 6.35,38.1
  pour Bottom (rank 5): 6.35,23.81 6.35,38.1 33.66,38.1 33.66,87.63 36.2,90.17 77.79,90.17 77.79,83.82 77.79,70.17 48.26,70.17 48.26,43.5 56.2,35.56 81.28,35.56 81.28,23.81
  pour Top (rank 2): 47.6,107.95 41.27,107.95 41.27,87 47.6,87
CS
  Top 0.406: SV1.6 92.62,106.77 92.67,106.77 102.96,96.47 102.96,96.43 SV5.4 102.96,94.07 102.96,94.03 99.86,90.92 93.46,90.92 U$4.D10
CURRENT_MON
  Top 0.406: U1.3 85.05,40.18 J5.P$2 100.33,42.11 100.33,68.26 101.36,69.29 108.31,69.29 110.59,71.58 110.59,74.8 109.55,75.84 103.78,75.84 U$4.A3
GND  (via drill 0.5)
  other vias: 4.19,65.35 14.12,84.3 23.42,85.78 25.92,118.34 55.07,118.11 59.13,103.81 87.2,95.63 62.61,40.49
  pour Top (rank 6): 0,0 99.69,0 104.46,0 104.46,66.36 127,66.36 127,127 0,127
  pour Bottom (rank 6): 0,0 104.46,0 104.46,66.36 127,66.36 127,127 0,127
MISO
  Top 0.406: SV1.4 94.03,102.87 100.42,96.47 100.42,96.43 SV5.5 100.42,94.07 100.42,94.03 98.23,91.83 89.29,91.83 U$4.D12
MON1
  Bottom 0.3: 81.38,88.8 78.74,91.44 34.29,91.44 31.11,88.27 31.11,62.23 29.84,60.96 24.66,60.96 21.38,57.68 19.48,57.68 19.06,57.26 U2.6
  Bottom 0.305: 81.38,88.8 81.38,73.55 83.93,71 109.1,71 U$4.A7
MON1A
  Bottom 0.3: U2.4 22.33,54.69 R17.1
  Bottom 0.406: 21.95,53.72 R17.1
  Bottom 3.81: F22.R2 27.89,51.55 F22.R1 24.13,51.53 R17.1 23.92,54.93 F22.R2
MON1B
  Bottom 0.3: U2.5 19.71,56.01 R17.2
  Bottom 0.406: 17.42,53.72 R17.2 | J7.P$1 6.87,53.23 5.76,52.12 5.73,52.12 5.49,51.88 5.49,51.85 5.08,51.44 5.08,49 LED13.N
  Bottom 3.81: J7.P$1 8.29,55.74 10.69,53.34 R17.2
MON2
  Top 0.3: U3.6 18.98,41.58 19.4,41.16 20.61,41.16 21.46,40.3 31.41,40.3 32.38,41.27 32.38,89.41 29.84,91.95 29.84,120.02 32.07,122.24 81.6,122.24 85.09,118.75 85.09,95.57 81.38,91.86 81.38,82.02 81.28,81.92
  Top 0.305: 81.28,81.92 81.28,73.65 83.99,70.94 106.5,70.94 U$4.A6
MON2A
  Top 0.3: U3.4 21.95,43.84 21.95,45.34
  Top 0.406: 21.95,45.34 R18.1
  Top 3.81: F19.R2 23.76,47.16 R18.1 24.29,43.76 F19.R1 27.89,43.77 F19.R2
MON2B
  Top 0.3: U3.5 19.63,43.13 17.42,45.34
  Top 0.406: 17.42,45.34 R18.2 | J7.P$2 6.87,46.33 LED14.N
  Top 3.81: J7.P$2 10.12,50.74 15.14,45.72 R18.2
MON3
  Top 0.3: 81.92,82.55 81.92,91.44 85.72,95.25 85.72,118.93 81.76,122.89 31.68,122.89 29.26,120.48 29.26,91.71 31.75,89.22 31.75,59.05 29.48,56.79 23.31,56.79 22.52,57.58 19.48,57.58 19.14,57.92 19.14,58.53 U4.6
  Top 0.305: 81.92,82.55 81.92,74.3 84.52,71.69 104.71,71.69 U$4.A5
MON3A
  Top 0.3: U4.4 22.33,60.48 R19.1
  Top 3.81: F20.R2 27.89,59.17 F20.R1 24.13,59.15 R19.1 23.92,62.55 F20.R2
MON3B
  Top 0.3: U4.5 19.64,58.68 19.64,59.29 17.97,60.96 R19.2
  Top 0.406: J7.P$3 6.87,63.22 5.49,64.6 5.49,68.03 LED15.N
  Top 3.81: R19.2 7.09,60.96 J7.P$3
MON4
  Bottom 0.3: 81.92,82.55 81.92,89.53 79.51,91.94 33.45,91.94 30.48,88.97 30.48,74.3 29.84,73.66 22.73,73.66 21.44,72.36 19.79,72.36 19.56,72.14 19.56,71.53 U5.6
  Bottom 0.305: 81.92,82.55 81.92,74.3 84.52,71.69 102.17,71.69 U$4.A4
MON4A
  Bottom 0.3: U5.4 20.74,69.53 R20.1
  Bottom 0.406: 21.92,68.35 R20.1
  Bottom 3.81: F21.R1 27.87,69.84 F21.R2 24.24,69.86 R20.1 23.82,66.46 F21.R1
MON4B
  Bottom 0.3: R20.2 19.58,70.48 19.76,70.48 20.09,70.81 U5.5
  Bottom 0.406: 17.4,68.3 R20.2 | J7.P$4 6.87,69.71 LED16.N
  Bottom 3.81: R20.2 9.07,67.94 J7.P$4
MOSI
  Bottom 0.406: SV1.3 94.03,100.33 97.88,96.47 97.88,96.43 SV5.6 97.88,94.07 97.88,94.03 97.08,93.23 93.18,93.23 88.9,88.95 U$4.D11
N$1
  pour Bottom: 1.27,109.25 25.08,109.25 25.08,89.85 1.27,89.85
N$2
  pour Top (rank 2): 18.73,105.73 25.08,105.73 25.08,89.85 1.27,89.85 1.27,105.73
N$3
  pour Top: 1.27,105.73 18.73,105.73 18.73,126.36 1.27,126.36
N$4
  Bottom 0.4: LED11.P 48.53,4.13 R11.2
N$5
  Bottom 0.4: R12.2 42.66,10.22 42.66,10.49 43.07,10.9 LED12.P
N$6
  pour Top (rank 2): 22.23,3.81 44.45,3.81 44.45,23.81 22.23,23.81
N$7
  pour Bottom (rank 2): 28.57,23.81 28.57,3.81 44.45,3.81 44.45,23.81
N$8
  pour Top (rank 2): 73.66,69.85 93.98,69.85 99.06,64.77 99.06,44.45 73.66,44.45
  pour Bottom (rank 2): 73.66,69.85 93.98,69.85 99.06,64.77 99.06,44.45 73.66,44.45
N$9
  Top 0.813: R5.2 50.8,113.22 J8.P$4
N$12
  pour Top: 31.11,121.91 31.11,92.78 41.41,92.78 41.41,109.35 45.72,113.67 45.72,121.91
N$13
  pour Top: 46.35,3.81 46.35,23.81 65.09,23.81 65.09,3.81
N$14
  pour Top (rank 2): 65.09,23.81 65.09,3.81 82.55,3.81 82.55,23.81
N$15
  pour Bottom (rank 2): 60.33,23.81 82.55,23.81 82.55,3.81 60.33,3.81
N$16
  pour Bottom: 60.33,23.81 60.33,3.81 44.45,3.81 44.45,23.81
N$18
  Top 0.4: R5.1 48.9,108.09 47.77,109.22 42.57,109.22 41.4,108.05 41.4,107.66 41.4,107.63 | 41.4,107.63 41.4,106.02 41.28,105.91 41.28,100.15 U$3.4 | U$2.4 41.4,107.63
  Top 0.813: R6.1 R5.1 | R5.1 | 48.89,106.68 R5.1
N$19
  Bottom 0.4: LED10.P 48.53,10.17 R10.2
N$20
  pour Top: 48.26,69.85 48.26,45.72 49.53,44.45 72.39,44.45 72.39,69.85
  pour Bottom: 48.26,69.85 48.26,45.72 49.53,44.45 72.39,44.45 72.39,69.85
N$21
  Bottom 0.4: LED8.P 80.53,5.23 79.85,4.55 79.58,4.55 79.17,4.14 79.17,3.87 R8.2
N$22
  Top 0.61: J10.86 61.83,97.5 61.83,115.61 J6.P$2
  Bottom 0.61: CR2.1 64.08,95.25 J10.86
N$24
  Bottom 0.4: LED9.P 79.77,10.9 79.58,10.9 78.47,9.79 R9.2
N$25
  pour Bottom (rank 2): 18.73,109.96 1.27,109.96 1.27,126.36 18.73,126.36
N$30
  Bottom 0.4: R1.2 42.66,3.87 42.66,4.23 43.07,4.64 LED1.P
N$31
  Bottom 0.4: R2.2 7.73,11.82 LED2.P
N$32
  Bottom 0.4: R3.2 9.41,6.24 LED3.P
N$33
  pour Top: 22.23,3.81 22.23,23.81 6.35,23.81 6.35,3.81
N$34
  pour Bottom: 28.57,23.81 28.57,3.81 6.35,3.81 6.35,23.81
N$36
  Bottom 0.4: LED16.P 4.32,76.48 R13.2
N$37
  Bottom 0.4: LED15.P 10.03,75.11 R14.2
N$38
  Bottom 0.4: LED14.P R15.2
N$39
  Bottom 0.4: LED13.P 10.1,39.63 R16.2
N$40
  pour Bottom: 69.22,119.38 69.22,100.33 81.92,100.33 81.92,119.38
  pour Top: 69.22,119.38 69.22,100.33 81.92,100.33 81.92,119.38
N$45
  Top 1.27: J10.87A 68.81,99.92 68.81,102.79 67,104.6 J6.P$1
SCK
  Top 0.406: SV1.5 90.17,105.41 88.27,103.5 88.27,99.69 88.9,99.06 90.12,99.06 90.22,99.15 92.67,99.15 95.34,96.47 95.34,96.43 SV5.7 95.34,94.07 95.34,94.03 94.06,92.74 87.35,92.74 84.81,90.19 84.81,75.21 U$4.D13
(copper drawn outside any net)
  shapes: Top area x5

### Text on the board
tPlace: HP2C | HP2 | HP2 | HP2 | HP1C | HP1 | HP1 | HP1 | WFR-2019 | CAN TxRx | PT1 | RST | CS | SCK | MISO | MOSI | +5V IN | PT2 | ARDUINO NANO | HP2 | M4 | M3 | HP1 | Power / Distribution / Module | Excellence. / Endurance. / Enthusiasm. | M4 | MAIN_12V_IN | M3 | M1 | Simplicity. / Integration. / Performance. | GND | M2 | Performance. / Integration. / Simplicity. | 5V_IN | Power / Distribution / Module | M2 | M1 | A1 | A2 | A3 | A4 | B1 | B2 | B3 | B4 | A3 | B1 | B3 | C1 | A1 | A4 | B2 | B4 | C2 | A2
bPlace: Excellence. Endurance. Enthusiasm.
tNames: P-MOD